# Altium schematic sheet 1_核心板.schdoc.schdoc
size 604 x 431 mm; Symbol: Sheet-Symbol_A4; Device: Sheet-Symbol_A4; Company: 嘉立创EDA; Version: V1.0; Page Size: A4; @Project Name: EP4CE22F17C8N; @Page Count: 1; @Update Date: 2023-09-30; @Create Date: 2023-07-21; @Schematic Name: Schematic1; @Page No: 1; @Page Name: 核心板
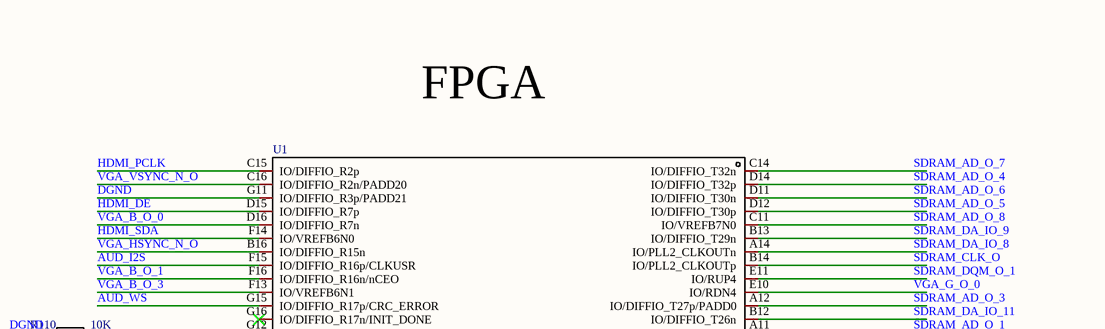
[diagram p0: 1_核心板.schdoc.schdoc, top left]
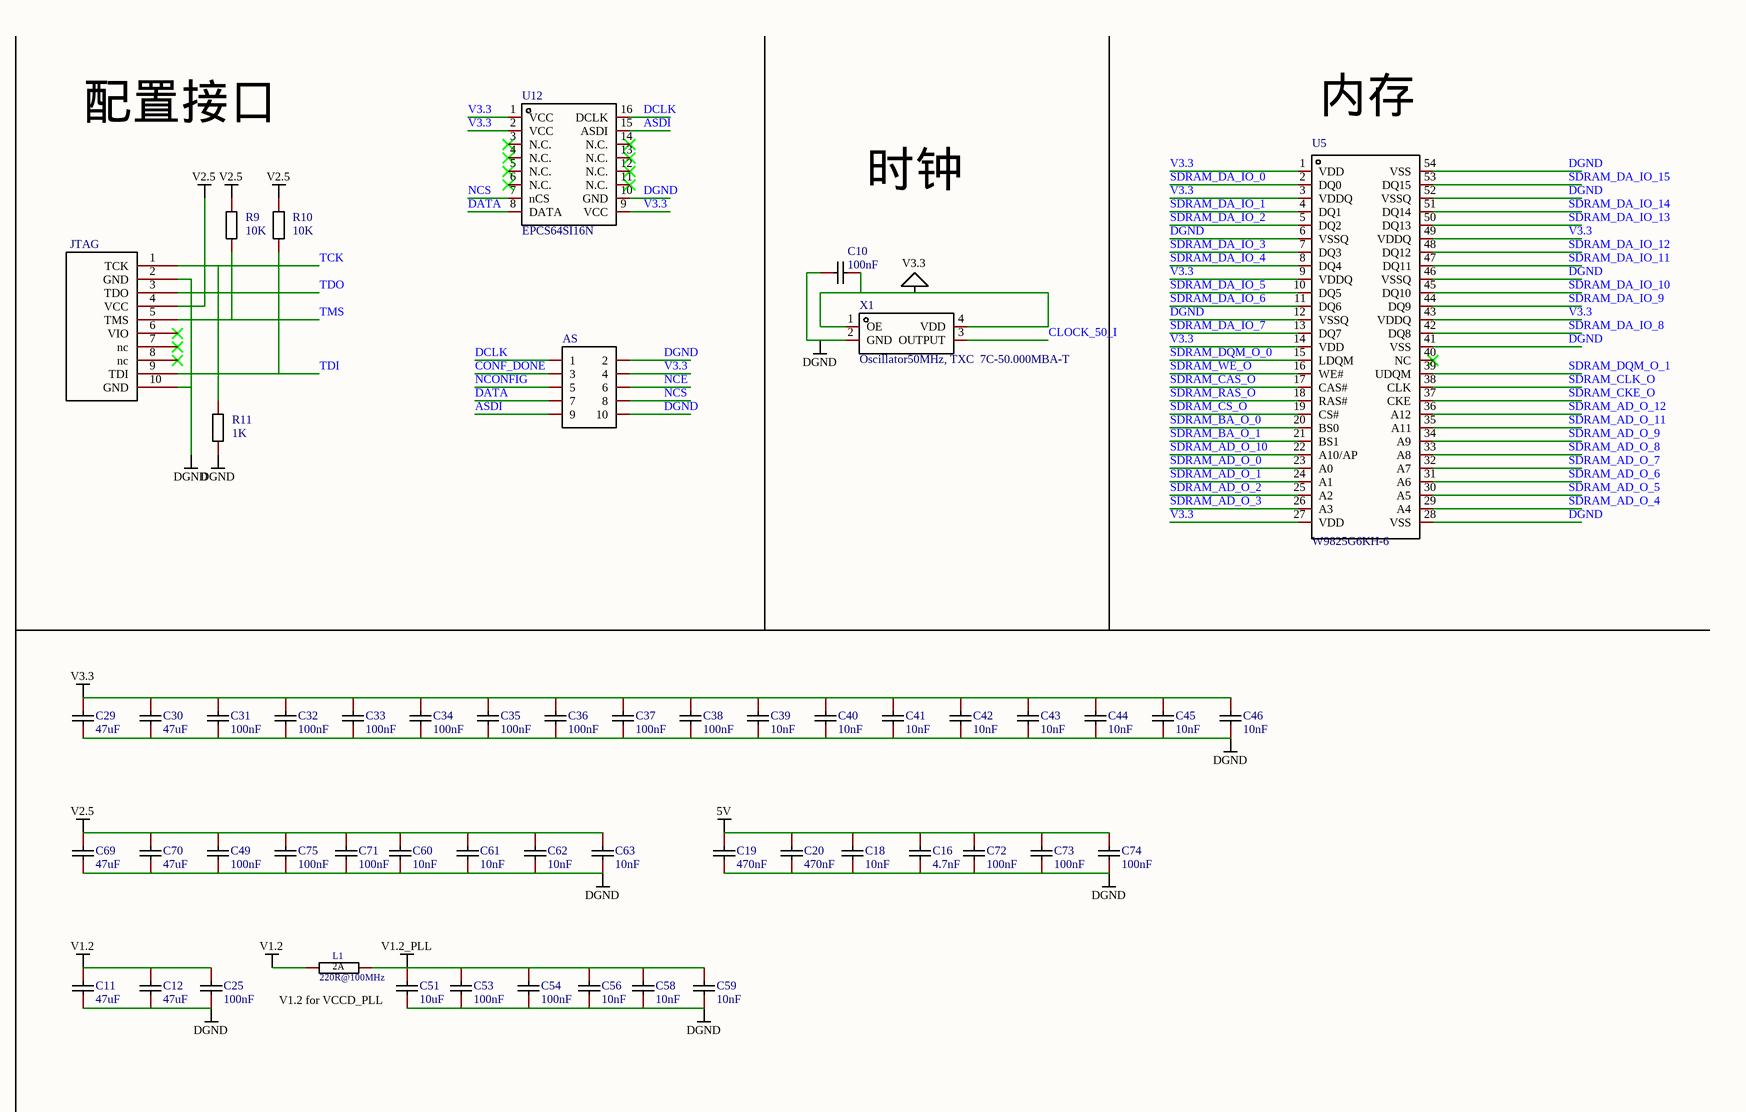
[diagram p1: 1_核心板.schdoc.schdoc, top right]
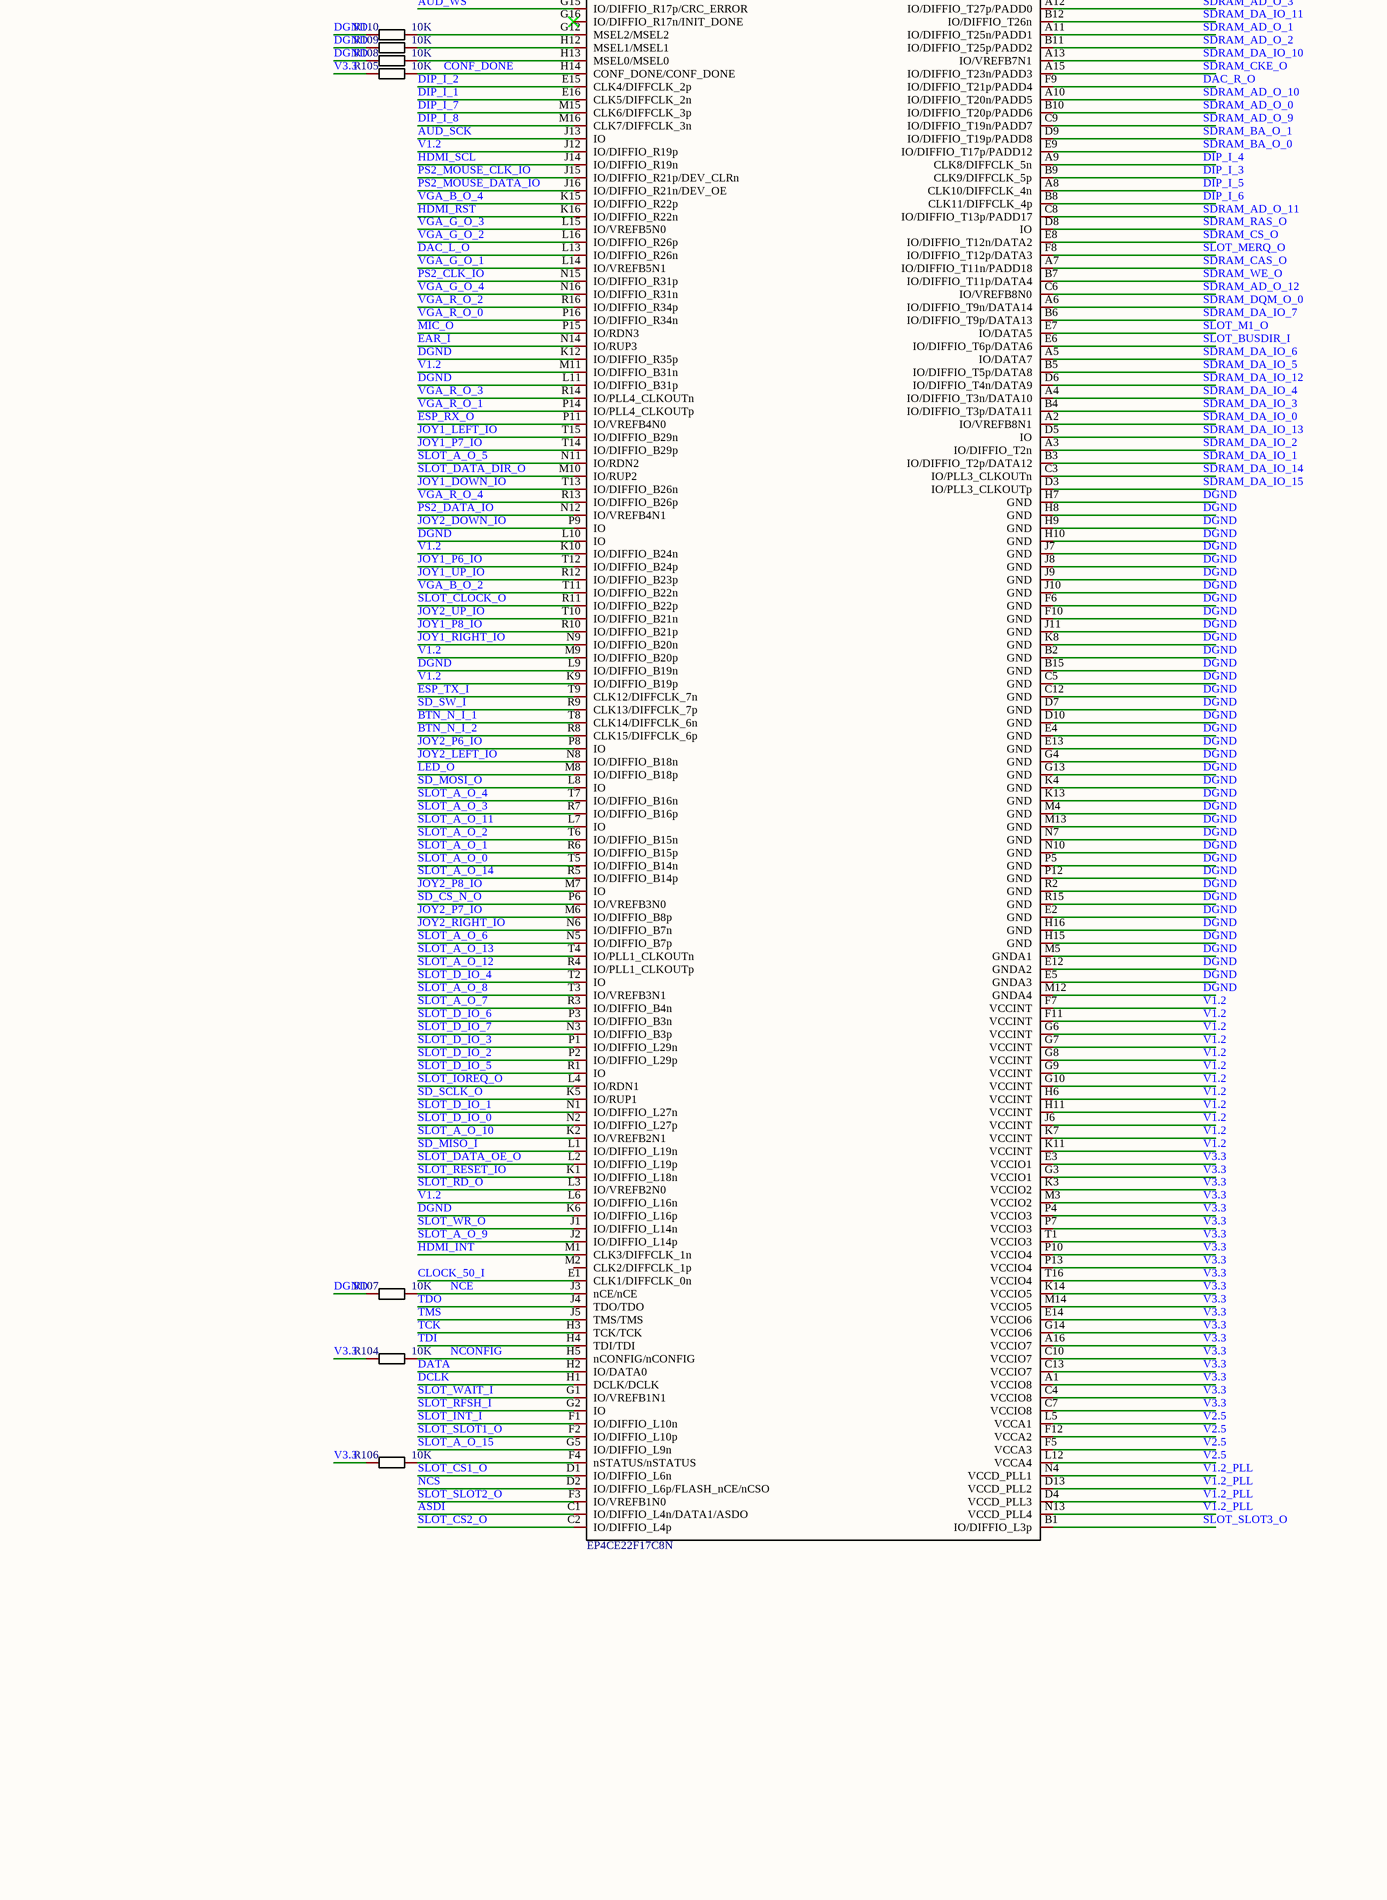
[diagram p2: 1_核心板.schdoc.schdoc, bottom left]
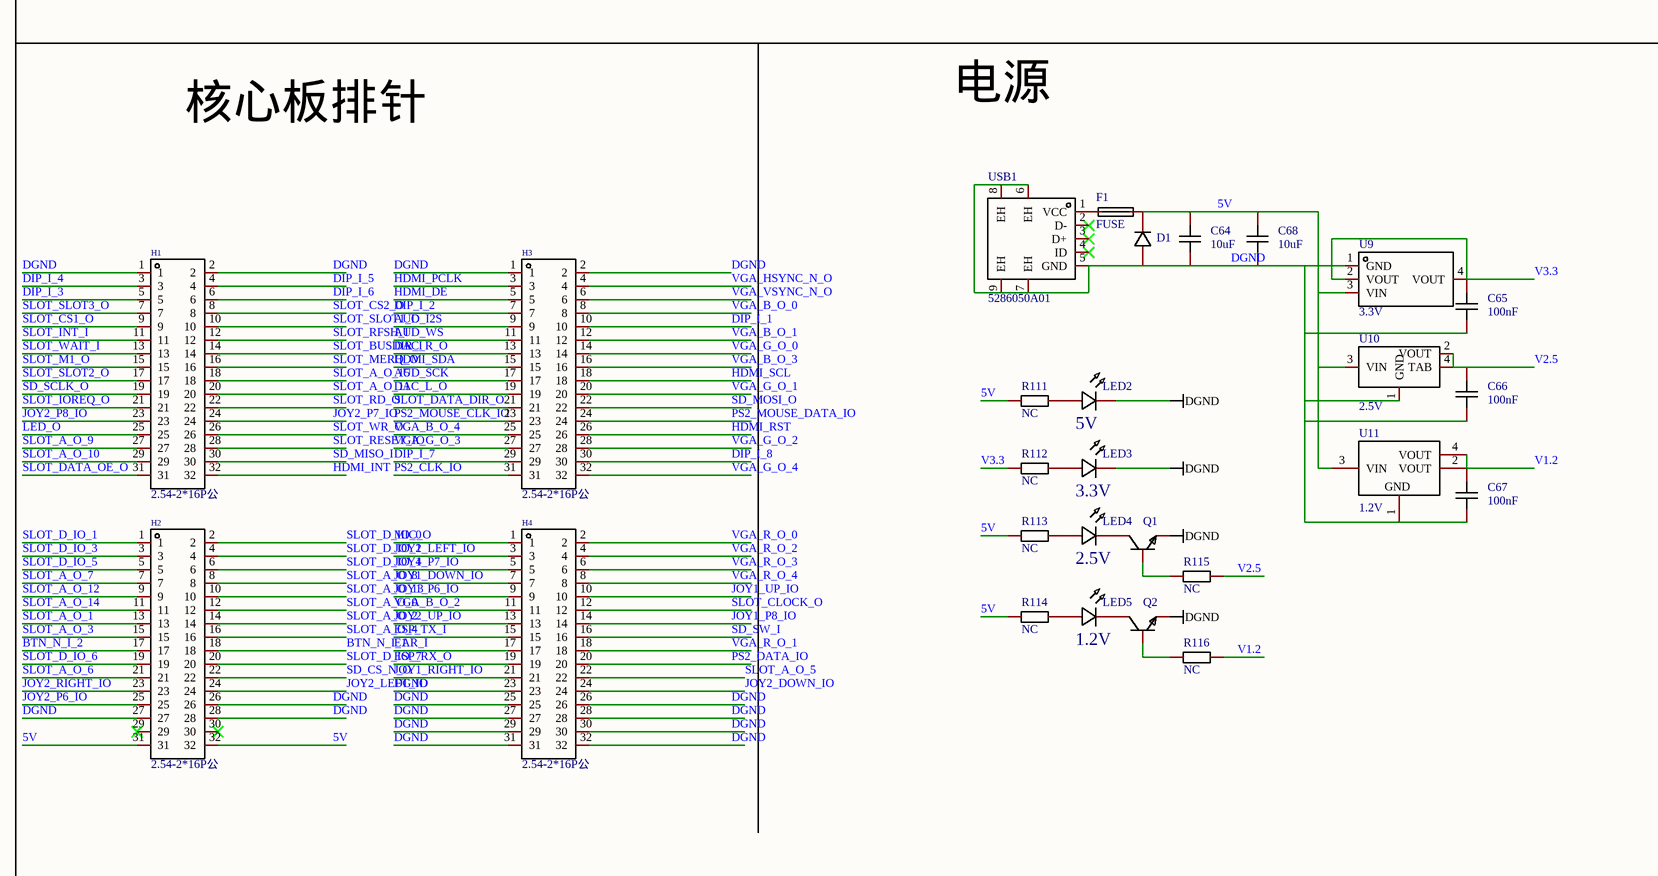
[diagram p3: 1_核心板.schdoc.schdoc, bottom right]

## Parts
AS  HDR-F_2.54_2x5  [HDR-TH_10P-P2.54-V-F-R2-C5-S2.54]  (value not drawn)
C10  100nF  [0603_3D]
C11  47uF  [0805_3D]
C12  47uF  [0805_3D]
C16  4.7nF  [0603_3D]
C18  10nF  [0603_3D]
C19  470nF  [0603_3D]
C20  470nF  [0603_3D]
C25  100nF  [0603_3D]
C29  47uF  [0805_3D]
C30  47uF  [0805_3D]
C31  100nF  [0603_3D]
C32  100nF  [0603_3D]
C33  100nF  [0603_3D]
C34  100nF  [0603_3D]
C35  100nF  [0603_3D]
C36  100nF  [0603_3D]
C37  100nF  [0603_3D]
C38  100nF  [0603_3D]
C39  10nF  [0603_3D]
C40  10nF  [0603_3D]
C41  10nF  [0603_3D]
C42  10nF  [0603_3D]
C43  10nF  [0603_3D]
C44  10nF  [0603_3D]
C45  10nF  [0603_3D]
C46  10nF  [0603_3D]
C49  100nF  [0603_3D]
C51  10uF  [0603_3D]
C53  100nF  [0603_3D]
C54  100nF  [0603_3D]
C56  10nF  [0603_3D]
C58  10nF  [0603_3D]
C59  10nF  [0603_3D]
C60  10nF  [0603_3D]
C61  10nF  [0603_3D]
C62  10nF  [0603_3D]
C63  10nF  [0603_3D]
C64  10uF  [C0805]
C65  100nF  [0603_3D]
C66  100nF  [0603_3D]
C67  100nF  [0603_3D]
C68  10uF  [C0805]
C69  47uF  [0805_3D]
C70  47uF  [0805_3D]
C71  100nF  [0603_3D]
C72  100nF  [0603_3D]
C73  100nF  [0603_3D]
C74  100nF  [0603_3D]
C75  100nF  [0603_3D]
D1  1N4148W  [SOD-123F_L2.7-W1.6-LS3.8-RD]  (value not drawn)
F1  FUSE  [F1206]
H1  2.54-2*16P公  [HDR-TH_32P-2.54-V-M-R2-C16-S2.54]
H2  2.54-2*16P公  [HDR-TH_32P-2.54-V-M-R2-C16-S2.54]
H3  2.54-2*16P公  [HDR-TH_32P-2.54-V-M-R2-C16-S2.54]
H4  2.54-2*16P公  [HDR-TH_32P-2.54-V-M-R2-C16-S2.54]
JTAG  JTAG  [HDR-TH_10P-P2.54-V-F-R2-C5-S2.54]  (value not drawn)
L1  220R@100MHz  [0603_3D]
LED2  5V  [LED_0603]
LED3  3.3V  [LED_0603]
LED4  2.5V  [LED_0603]
LED5  1.2V  [LED_0603]
Q1  S8050_SOT_NPN  [S8050_SOT-23]  (value not drawn)
Q2  S8050_SOT_NPN  [S8050_SOT-23]  (value not drawn)
R9  10k  [0603_3D]
R10  10k  [0603_3D]
R11  1k  [0603_3D]
R104  10k  [0603_3D]
R105  10k  [0603_3D]
R106  10k  [0603_3D]
R107  10k  [0603_3D]
R108  10k  [0603_3D]
R109  10k  [0603_3D]
R110  10k  [0603_3D]
R111  NC  [R0603]
R112  NC  [R0603]
R113  NC  [R0603]
R114  NC  [R0603]
R115  NC  [R0603]
R116  NC  [R0603]
U1  EP4CE22F17C8N  [FBGA-256_L17.0-W17.0-R16-C16-P1.00-TL]
U5  W9825G6KH-6  [TSOP-54_L22.2-W10.2-P0.80-LS11.8-BL]
U9  3.3V  [SOT-223-3_L6.5-W3.4-P2.30-LS7.0-BR]
U10  2.5V  [SOT-223_L6.7-W3.5-P2.30-BR]
U11  1.2V  [SOT-223-3_L6.5-W3.4-P2.30-LS7.0-BR]
U12  EPCS64SI16N  [SOIC-16_L12.8-W7.5-P1.27-LS10.3-BL]
USB1  5286050A01  [MINI-USB-SMD_PAI_MINUSB_5P]
X1  Oscillator50MHz, TXC  7C-50.000MBA-T  [OSC-SMD_4P-L3.2-W2.5-BL]

## Nets
5V: C16.2 C18.2 C19.2 C20.2 C64.2 C68.2 C72.2 C73.2 C74.2 D1.1(K) F1.2 H2.31 H2.32 R111.2 R113.1 R114.1 U9.3(VIN) U10.3(VIN) U11.3(VIN)
DGND: AS.2 AS.10 C10.2 C11.1 C12.1 C16.1 C18.1 C19.1 C20.1 C25.1 C29.1 C30.1 C31.1 C32.1 C33.1 C34.1 C35.1 C36.1 C37.1 C38.1 C39.1 C40.1 C41.1 C42.1 C43.1 C44.1 C45.1 C46.1 C49.1 C51.1 C53.1 C54.1 C56.1 C58.1 C59.1 C60.1 C61.1 C62.1 C63.1 C64.1 C65.1 C66.1 C67.1 C68.1 C69.1 C70.1 C71.1 C72.1 C73.1 C74.1 C75.1 D1.2(A) H1.1 H1.2 H2.26 H2.27 H2.28 H3.1 H3.2 H4.23 H4.25 H4.26 H4.27 H4.28 H4.29 H4.30 H4.31 H4.32 JTAG.2(GND) JTAG.10(GND) LED2.1(C) LED3.1(C) Q1.2 Q2.2 R11.2 R107.2 R108.2 R109.2 R110.2 U1.B2(GND) U1.B15(GND) U1.C5(GND) U1.C12(GND) U1.D7(GND) U1.D10(GND) U1.E2(GND) U1.E4(GND) U1.E5(GNDA3) U1.E12(GNDA2) U1.E13(GND) U1.F6(GND) U1.F10(GND) U1.G4(GND) U1.G11(IO/DIFFIO_R3p/PADD21) U1.G13(GND) U1.H7(GND) U1.H8(GND) U1.H9(GND) U1.H10(GND) U1.H15(GND) U1.H16(GND) U1.J7(GND) U1.J8(GND) U1.J9(GND) U1.J10(GND) U1.J11(GND) U1.K4(GND) U1.K6(IO/DIFFIO_L16p) U1.K8(GND) U1.K12(IO/DIFFIO_R35p) U1.K13(GND) U1.L9(IO/DIFFIO_B19n) U1.L10(IO) U1.L11(IO/DIFFIO_B31p) U1.M4(GND) U1.M5(GNDA1) U1.M12(GNDA4) U1.M13(GND) U1.N7(GND) U1.N10(GND) U1.P5(GND) U1.P12(GND) U1.R2(GND) U1.R15(GND) U5.6(VSSQ) U5.12(VSSQ) U5.28(VSS) U5.41(VSS) U5.46(VSSQ) U5.52(VSSQ) U5.54(VSS) U9.1(GND) U10.1(GND) U11.1(GND) U12.10(GND) USB1.5(GND) USB1.6(EH) USB1.7(EH) USB1.8(EH) USB1.9(EH) X1.2(GND)
V1.2: C11.2 C12.2 C25.2 C67.2 L1.1 R116.2 U1.F7(VCCINT) U1.F11(VCCINT) U1.G6(VCCINT) U1.G7(VCCINT) U1.G8(VCCINT) U1.G9(VCCINT) U1.G10(VCCINT) U1.H6(VCCINT) U1.H11(VCCINT) U1.J6(VCCINT) U1.J12(IO/DIFFIO_R19p) U1.K7(VCCINT) U1.K9(IO/DIFFIO_B19p) U1.K10(IO/DIFFIO_B24n) U1.K11(VCCINT) U1.L6(IO/DIFFIO_L16n) U1.M9(IO/DIFFIO_B20p) U1.M11(IO/DIFFIO_B31n) U11.2(VOUT) U11.4(VOUT)
V1.2_PLL: C51.2 C53.2 C54.2 C56.2 C58.2 C59.2 L1.2 U1.D4(VCCD_PLL3) U1.D13(VCCD_PLL2) U1.N4(VCCD_PLL1) U1.N13(VCCD_PLL4)
V2.5: C49.2 C60.2 C61.2 C62.2 C63.2 C66.2 C69.2 C70.2 C71.2 C75.2 JTAG.4(VCC) R9.2 R10.2 R115.2 U1.F5(VCCA3) U1.F12(VCCA2) U1.L5(VCCA1) U1.L12(VCCA4) U10.2(VOUT) U10.4(TAB)
V3.3: AS.4 C10.1 C29.2 C30.2 C31.2 C32.2 C33.2 C34.2 C35.2 C36.2 C37.2 C38.2 C39.2 C40.2 C41.2 C42.2 C43.2 C44.2 C45.2 C46.2 C65.2 R104.2 R105.2 R106.2 R112.2 U1.A1(VCCIO8) U1.A16(VCCIO7) U1.C4(VCCIO8) U1.C7(VCCIO8) U1.C10(VCCIO7) U1.C13(VCCIO7) U1.E3(VCCIO1) U1.E14(VCCIO6) U1.G3(VCCIO1) U1.G14(VCCIO6) U1.K3(VCCIO2) U1.K14(VCCIO5) U1.M3(VCCIO2) U1.M14(VCCIO5) U1.P4(VCCIO3) U1.P7(VCCIO3) U1.P10(VCCIO4) U1.P13(VCCIO4) U1.T1(VCCIO3) U1.T16(VCCIO4) U5.1(VDD) U5.3(VDDQ) U5.9(VDDQ) U5.14(VDD) U5.27(VDD) U5.43(VDDQ) U5.49(VDDQ) U9.2(VOUT) U9.4(VOUT) U12.1(VCC) U12.2(VCC) U12.9(VCC) X1.1(OE) X1.4(VDD)
ASDI: AS.9 U1.C1(IO/DIFFIO_L4n/DATA1/ASDO) U12.15(ASDI)
AUD_I2S: H3.9 U1.F15(IO/DIFFIO_R16p/CLKUSR)
AUD_SCK: H3.17 U1.J13(IO)
AUD_WS: H3.11 U1.G15(IO/DIFFIO_R17p/CRC_ERROR)
BTN_N_I_1: H2.18 U1.T8(CLK14/DIFFCLK_6n)
BTN_N_I_2: H2.17 U1.R8(CLK15/DIFFCLK_6p)
CLOCK_50_I: U1.E1(CLK1/DIFFCLK_0n) X1.3(OUTPUT)
CONF_DONE: AS.3 R105.1 U1.H14(CONF_DONE/CONF_DONE)
DAC_L_O: H3.19 U1.L13(IO/DIFFIO_R26n)
DAC_R_O: H3.13 U1.F9(IO/DIFFIO_T21p/PADD4)
DATA: AS.7 U1.H2(IO/DATA0) U12.8(DATA)
DCLK: AS.1 U1.H1(DCLK/DCLK) U12.16(DCLK)
DIP_I_1: H3.10 U1.E16(CLK5/DIFFCLK_2n)
DIP_I_2: H3.7 U1.E15(CLK4/DIFFCLK_2p)
DIP_I_3: H1.5 U1.B9(CLK9/DIFFCLK_5p)
DIP_I_4: H1.3 U1.A9(CLK8/DIFFCLK_5n)
DIP_I_5: H1.4 U1.A8(CLK10/DIFFCLK_4n)
DIP_I_6: H1.6 U1.B8(CLK11/DIFFCLK_4p)
DIP_I_7: H3.29 U1.M15(CLK6/DIFFCLK_3p)
DIP_I_8: H3.30 U1.M16(CLK7/DIFFCLK_3n)
EAR_I: H4.17 U1.N14(IO/RUP3)
ESP_RX_O: H4.19 U1.P11(IO/VREFB4N0)
ESP_TX_I: H4.15 U1.T9(CLK12/DIFFCLK_7n)
HDMI_DE: H3.5 U1.D15(IO/DIFFIO_R7p)
HDMI_INT: H1.32 U1.M1(CLK3/DIFFCLK_1n)
HDMI_PCLK: H3.3 U1.C15(IO/DIFFIO_R2p)
HDMI_RST: H3.26 U1.K16(IO/DIFFIO_R22n)
HDMI_SCL: H3.18 U1.J14(IO/DIFFIO_R19n)
HDMI_SDA: H3.15 U1.F14(IO/VREFB6N0)
JOY1_DOWN_IO: H4.7 U1.T13(IO/DIFFIO_B26n)
JOY1_LEFT_IO: H4.3 U1.T15(IO/DIFFIO_B29n)
JOY1_P6_IO: H4.9 U1.T12(IO/DIFFIO_B24p)
JOY1_P7_IO: H4.5 U1.T14(IO/DIFFIO_B29p)
JOY1_P8_IO: H4.14 U1.R10(IO/DIFFIO_B21p)
JOY1_RIGHT_IO: H4.21 U1.N9(IO/DIFFIO_B20n)
JOY1_UP_IO: H4.10 U1.R12(IO/DIFFIO_B23p)
JOY2_DOWN_IO: H4.24 U1.P9(IO)
JOY2_LEFT_IO: H2.24 U1.N8(IO/DIFFIO_B18n)
JOY2_P6_IO: H2.25 U1.P8(IO)
JOY2_P7_IO: H1.24 U1.M6(IO/DIFFIO_B8p)
JOY2_P8_IO: H1.23 U1.M7(IO)
JOY2_RIGHT_IO: H2.23 U1.N6(IO/DIFFIO_B7n)
JOY2_UP_IO: H4.13 U1.T10(IO/DIFFIO_B21n)
LED_O: H1.25 U1.M8(IO/DIFFIO_B18p)
MIC_O: H4.1 U1.P15(IO/RDN3)
NCE: AS.6 R107.1 U1.J3(nCE/nCE)
NCONFIG: AS.5 R104.1 U1.H5(nCONFIG/nCONFIG)
NCS: AS.8 U1.D2(IO/DIFFIO_L6p/FLASH_nCE/nCSO) U12.7(nCS)
PS2_CLK_IO: H3.31 U1.N15(IO/DIFFIO_R31p)
PS2_DATA_IO: H4.20 U1.N12(IO/VREFB4N1)
PS2_MOUSE_CLK_IO: H3.23 U1.J15(IO/DIFFIO_R21p/DEV_CLRn)
PS2_MOUSE_DATA_IO: H3.24 U1.J16(IO/DIFFIO_R21n/DEV_OE)
SD_CS_N_O: H2.22 U1.P6(IO/VREFB3N0)
SD_MISO_I: H1.30 U1.L1(IO/DIFFIO_L19n)
SD_MOSI_O: H3.22 U1.L8(IO)
SD_SCLK_O: H1.19 U1.K5(IO/RUP1)
SD_SW_I: H4.16 U1.R9(CLK13/DIFFCLK_7p)
SDRAM_AD_O_0: U1.B10(IO/DIFFIO_T20p/PADD6) U5.23(A0)
SDRAM_AD_O_1: U1.A11(IO/DIFFIO_T25n/PADD1) U5.24(A1)
SDRAM_AD_O_2: U1.B11(IO/DIFFIO_T25p/PADD2) U5.25(A2)
SDRAM_AD_O_3: U1.A12(IO/DIFFIO_T27p/PADD0) U5.26(A3)
SDRAM_AD_O_4: U1.D14(IO/DIFFIO_T32p) U5.29(A4)
SDRAM_AD_O_5: U1.D12(IO/DIFFIO_T30p) U5.30(A5)
SDRAM_AD_O_6: U1.D11(IO/DIFFIO_T30n) U5.31(A6)
SDRAM_AD_O_7: U1.C14(IO/DIFFIO_T32n) U5.32(A7)
SDRAM_AD_O_8: U1.C11(IO/VREFB7N0) U5.33(A8)
SDRAM_AD_O_9: U1.C9(IO/DIFFIO_T19n/PADD7) U5.34(A9)
SDRAM_AD_O_10: U1.A10(IO/DIFFIO_T20n/PADD5) U5.22(A10/AP)
SDRAM_AD_O_11: U1.C8(IO/DIFFIO_T13p/PADD17) U5.35(A11)
SDRAM_AD_O_12: U1.C6(IO/VREFB8N0) U5.36(A12)
SDRAM_BA_O_0: U1.E9(IO/DIFFIO_T17p/PADD12) U5.20(BS0)
SDRAM_BA_O_1: U1.D9(IO/DIFFIO_T19p/PADD8) U5.21(BS1)
SDRAM_CAS_O: U1.A7(IO/DIFFIO_T11n/PADD18) U5.17(CAS#)
SDRAM_CKE_O: U1.A15(IO/DIFFIO_T23n/PADD3) U5.37(CKE)
SDRAM_CLK_O: U1.B14(IO/PLL2_CLKOUTp) U5.38(CLK)
SDRAM_CS_O: U1.E8(IO/DIFFIO_T12n/DATA2) U5.19(CS#)
SDRAM_DA_IO_0: U1.A2(IO/VREFB8N1) U5.2(DQ0)
SDRAM_DA_IO_1: U1.B3(IO/DIFFIO_T2p/DATA12) U5.4(DQ1)
SDRAM_DA_IO_2: U1.A3(IO/DIFFIO_T2n) U5.5(DQ2)
SDRAM_DA_IO_3: U1.B4(IO/DIFFIO_T3p/DATA11) U5.7(DQ3)
SDRAM_DA_IO_4: U1.A4(IO/DIFFIO_T3n/DATA10) U5.8(DQ4)
SDRAM_DA_IO_5: U1.B5(IO/DIFFIO_T5p/DATA8) U5.10(DQ5)
SDRAM_DA_IO_6: U1.A5(IO/DATA7) U5.11(DQ6)
SDRAM_DA_IO_7: U1.B6(IO/DIFFIO_T9p/DATA13) U5.13(DQ7)
SDRAM_DA_IO_8: U1.A14(IO/PLL2_CLKOUTn) U5.42(DQ8)
SDRAM_DA_IO_9: U1.B13(IO/DIFFIO_T29n) U5.44(DQ9)
SDRAM_DA_IO_10: U1.A13(IO/VREFB7N1) U5.45(DQ10)
SDRAM_DA_IO_11: U1.B12(IO/DIFFIO_T26n) U5.47(DQ11)
SDRAM_DA_IO_12: U1.D6(IO/DIFFIO_T4n/DATA9) U5.48(DQ12)
SDRAM_DA_IO_13: U1.D5(IO) U5.50(DQ13)
SDRAM_DA_IO_14: U1.C3(IO/PLL3_CLKOUTn) U5.51(DQ14)
SDRAM_DA_IO_15: U1.D3(IO/PLL3_CLKOUTp) U5.53(DQ15)
SDRAM_DQM_O_0: U1.A6(IO/DIFFIO_T9n/DATA14) U5.15(LDQM)
SDRAM_DQM_O_1: U1.E11(IO/RUP4) U5.39(UDQM)
SDRAM_RAS_O: U1.D8(IO) U5.18(RAS#)
SDRAM_WE_O: U1.B7(IO/DIFFIO_T11p/DATA4) U5.16(WE#)
SLOT_A_O_0: H2.12 U1.T5(IO/DIFFIO_B14n)
SLOT_A_O_1: H2.13 U1.R6(IO/DIFFIO_B15p)
SLOT_A_O_2: H2.14 U1.T6(IO/DIFFIO_B15n)
SLOT_A_O_3: H2.15 U1.R7(IO/DIFFIO_B16p)
SLOT_A_O_4: H2.16 U1.T7(IO/DIFFIO_B16n)
SLOT_A_O_5: H4.22 U1.N11(IO/RDN2)
SLOT_A_O_6: H2.21 U1.N5(IO/DIFFIO_B7p)
SLOT_A_O_7: H2.7 U1.R3(IO/DIFFIO_B4n)
SLOT_A_O_8: H2.8 U1.T3(IO/VREFB3N1)
SLOT_A_O_9: H1.27 U1.J2(IO/DIFFIO_L14p)
SLOT_A_O_10: H1.29 U1.K2(IO/VREFB2N1)
SLOT_A_O_11: H1.20 U1.L7(IO)
SLOT_A_O_12: H2.9 U1.R4(IO/PLL1_CLKOUTp)
SLOT_A_O_13: H2.10 U1.T4(IO/PLL1_CLKOUTn)
SLOT_A_O_14: H2.11 U1.R5(IO/DIFFIO_B14p)
SLOT_A_O_15: H1.18 U1.G5(IO/DIFFIO_L9n)
SLOT_BUSDIR_I: H1.14 U1.E6(IO/DIFFIO_T6p/DATA6)
SLOT_CLOCK_O: H4.12 U1.R11(IO/DIFFIO_B22p)
SLOT_CS1_O: H1.9 U1.D1(IO/DIFFIO_L6n)
SLOT_CS2_O: H1.8 U1.C2(IO/DIFFIO_L4p)
SLOT_D_IO_0: H2.2 U1.N2(IO/DIFFIO_L27p)
SLOT_D_IO_1: H2.1 U1.N1(IO/DIFFIO_L27n)
SLOT_D_IO_2: H2.4 U1.P2(IO/DIFFIO_L29p)
SLOT_D_IO_3: H2.3 U1.P1(IO/DIFFIO_L29n)
SLOT_D_IO_4: H2.6 U1.T2(IO)
SLOT_D_IO_5: H2.5 U1.R1(IO)
SLOT_D_IO_6: H2.19 U1.P3(IO/DIFFIO_B3n)
SLOT_D_IO_7: H2.20 U1.N3(IO/DIFFIO_B3p)
SLOT_DATA_DIR_O: H3.21 U1.M10(IO/RUP2)
SLOT_DATA_OE_O: H1.31 U1.L2(IO/DIFFIO_L19p)
SLOT_INT_I: H1.11 U1.F1(IO/DIFFIO_L10n)
SLOT_IOREQ_O: H1.21 U1.L4(IO/RDN1)
SLOT_M1_O: H1.15 U1.E7(IO/DATA5)
SLOT_MERQ_O: H1.16 U1.F8(IO/DIFFIO_T12p/DATA3)
SLOT_RD_O: H1.22 U1.L3(IO/VREFB2N0)
SLOT_RESET_IO: H1.28 U1.K1(IO/DIFFIO_L18n)
SLOT_RFSH_I: H1.12 U1.G2(IO)
SLOT_SLOT1_O: H1.10 U1.F2(IO/DIFFIO_L10p)
SLOT_SLOT2_O: H1.17 U1.F3(IO/VREFB1N0)
SLOT_SLOT3_O: H1.7 U1.B1(IO/DIFFIO_L3p)
SLOT_WAIT_I: H1.13 U1.G1(IO/VREFB1N1)
SLOT_WR_O: H1.26 U1.J1(IO/DIFFIO_L14n)
TCK: JTAG.1(TCK) R11.1 U1.H3(TCK/TCK)
TDI: JTAG.9(TDI) R10.1 U1.H4(TDI/TDI)
TDO: JTAG.3(TDO) U1.J4(TDO/TDO)
TMS: JTAG.5(TMS) R9.1 U1.J5(TMS/TMS)
VGA_B_O_0: H3.8 U1.D16(IO/DIFFIO_R7n)
VGA_B_O_1: H3.12 U1.F16(IO/DIFFIO_R16n/nCEO)
VGA_B_O_2: H4.11 U1.T11(IO/DIFFIO_B22n)
VGA_B_O_3: H3.16 U1.F13(IO/VREFB6N1)
VGA_B_O_4: H3.25 U1.K15(IO/DIFFIO_R22p)
VGA_G_O_0: H3.14 U1.E10(IO/RDN4)
VGA_G_O_1: H3.20 U1.L14(IO/VREFB5N1)
VGA_G_O_2: H3.28 U1.L16(IO/DIFFIO_R26p)
VGA_G_O_3: H3.27 U1.L15(IO/VREFB5N0)
VGA_G_O_4: H3.32 U1.N16(IO/DIFFIO_R31n)
VGA_HSYNC_N_O: H3.4 U1.B16(IO/DIFFIO_R15n)
VGA_R_O_0: H4.2 U1.P16(IO/DIFFIO_R34n)
VGA_R_O_1: H4.18 U1.P14(IO/PLL4_CLKOUTp)
VGA_R_O_2: H4.4 U1.R16(IO/DIFFIO_R34p)
VGA_R_O_3: H4.6 U1.R14(IO/PLL4_CLKOUTn)
VGA_R_O_4: H4.8 U1.R13(IO/DIFFIO_B26p)
VGA_VSYNC_N_O: H3.6 U1.C16(IO/DIFFIO_R2n/PADD20)
NetF1_1: F1.1 USB1.1(VCC)
NetLED2_2: LED2.2(A) R111.1
NetLED3_2: LED3.2(A) R112.1
NetLED4_1: LED4.1(C) Q1.3
NetLED4_2: LED4.2(A) R113.2
NetLED5_1: LED5.1(C) Q2.3
NetLED5_2: LED5.2(A) R114.2
NetQ1_1: Q1.1 R115.1
NetQ2_1: Q2.1 R116.1
NetR106_1: R106.1 U1.F4(nSTATUS/nSTATUS)
NetR108_1: R108.1 U1.H13(MSEL0/MSEL0)
NetR109_1: R109.1 U1.H12(MSEL1/MSEL1)
NetR110_1: R110.1 U1.G12(MSEL2/MSEL2)

Not connected (* = marked no-connect by the designer): H2 29* 30*; JTAG 6(VIO)* 7(nc)* 8(nc)*; U1 G16(IO/DIFFIO_R17n/INIT_DONE)* M2(CLK2/DIFFCLK_1p); U5 40(NC)*; U12 3(N.C.)* 4(N.C.)* 5(N.C.)* 6(N.C.)* 11(N.C.)* 12(N.C.)* 13(N.C.)* 14(N.C.)*; USB1 2(D-)* 3(D+)* 4(ID)*

## Notes on the sheet
- FPGA
- 配置接口
- (near U5) 内存
- 时钟
- V1.2 for VCCD_PLL
- 核心板排针
- 电源
- 1
- 2
- 3
- 4
- 5
- 6
- A
- B
- C
- D
- 原理图
- Schematic1
- 创建日期
- 更新日期
- 2023-09-30
- 2023-07-21
- 审阅
- 绘制
- 图页
- 核心板
- 物料编码
- EP4CE22F17C8N
- 版本
- 尺寸
- 页
- 共
- V1.0
- A4
- 嘉立创EDA

## Library data of the parts
AS = HDR-F_2.54_2x5: Symbol: HDR-F-2.54_2x5; Convert to PCB: yes; Device: HDR-F_2.54_2x5; Add into BOM: yes; Supplier Part: C92270; Supplier Footprint: 插件
C10 = 100nF: Capacitor; #Manufacturer: Generic Components; Symbol: C; #Publisher: Dr. A. Heinzelmann; #Class: Passive; Initial Voltage: 0V; Origin Footprint 2: 1210; Origin Footprint 3: CC-Type-B-3528; Origin Footprint 4: 1206; Origin Footprint 5: 0402; Origin Footprint 6: 1812; Origin Footprint 7: 0402 - R; Origin Footprint 8: 0805 - R; Origin Footprint 9: 1206 - R; Add into BOM: yes; Name: 100nF; Device: 100nF; #Published: 2006-10-07; #ClassSub: Capacitor; Type: *; Voltage Maximum: *; Value: 100nF; Convert to PCB: yes; Origin Footprint 1: 0603_3D; Design Item ID: C; Library Name: EFS_Sensorboard
C11 C12 C29 C30 C69 C70 = 47uF: Capacitor; #Manufacturer: Generic Components; Symbol: C; #Publisher: Dr. A. Heinzelmann; #Class: Passive; Initial Voltage: 0V; Type: Ceramic; Origin Footprint 2: 1210; Origin Footprint 3: CC-Type-B-3528; Origin Footprint 4: 1206; Origin Footprint 5: 0402; Origin Footprint 6: 1812; Origin Footprint 7: 0402 - R; Origin Footprint 8: 1206 - R; Origin Footprint 9: 0603_3D; Add into BOM: yes; Name: 47uF; Device: 47uF; #Published: 2006-10-07; #ClassSub: Capacitor; Voltage Maximum: *; Value: 47uF; Convert to PCB: yes; Origin Footprint 1: 0805_3D; Design Item ID: C; Library Name: EFS_Sensorboard
C16 = 4.7nF: Capacitor; #Manufacturer: Generic Components; Symbol: C; #Publisher: Dr. A. Heinzelmann; #Class: Passive; Initial Voltage: 0V; Origin Footprint 2: 1210; Origin Footprint 3: CC-Type-B-3528; Origin Footprint 4: 1206; Origin Footprint 5: 0402_3D; Origin Footprint 6: 1812; Origin Footprint 8: 0805 - R; Origin Footprint 9: 1206 - R; Add into BOM: yes; Name: 4.7nF; Device: 4.7nF; #Published: 2006-10-07; #ClassSub: Capacitor; Type: *; Voltage Maximum: *; Value: 4.7nF; Origin Footprint 7: 0402_3D; Convert to PCB: yes; Origin Footprint 1: 0402_3D; Design Item ID: C; Library Name: EFS_Sensorboard
C18 = 10nF: Capacitor; #Manufacturer: Generic Components; Symbol: C; #Publisher: Dr. A. Heinzelmann; #Class: Passive; Initial Voltage: 0V; Origin Footprint 2: 1210; Origin Footprint 3: CC-Type-B-3528; Origin Footprint 4: 1206; Origin Footprint 5: 0402_3D; Origin Footprint 6: 1812; Origin Footprint 8: 0805 - R; Origin Footprint 9: 1206 - R; Add into BOM: yes; Name: 10nF; Device: 10nF; #Published: 2006-10-07; #ClassSub: Capacitor; Type: *; Voltage Maximum: *; Value: 10nF; Origin Footprint 7: 0402_3D; Convert to PCB: yes; Origin Footprint 1: 0402_3D; Design Item ID: C; Library Name: EFS_Sensorboard
C19 C20 = 470nF: Capacitor; #Manufacturer: Generic Components; Symbol: C; #Publisher: Dr. A. Heinzelmann; #Class: Passive; Initial Voltage: 0V; Origin Footprint 2: 1210; Origin Footprint 3: CC-Type-B-3528; Origin Footprint 4: 1206; Origin Footprint 5: 0402_3D; Origin Footprint 6: 1812; Origin Footprint 7: 0402 - R; Origin Footprint 8: 0805 - R; Origin Footprint 9: 1206 - R; Add into BOM: yes; Name: 470nF; Device: 470nF; #Published: 2006-10-07; #ClassSub: Capacitor; Type: *; Voltage Maximum: *; Value: 470nF; Convert to PCB: yes; Origin Footprint 1: 0603_3D; Design Item ID: C; Library Name: EFS_Sensorboard
C25 C72-C74 = 100nF: Capacitor; #Manufacturer: Generic Components; Symbol: C; #Publisher: Dr. A. Heinzelmann; #Class: Passive; Initial Voltage: 0V; Origin Footprint 2: 1210; Origin Footprint 3: CC-Type-B-3528; Origin Footprint 4: 1206; Origin Footprint 5: 0402_3D; Origin Footprint 6: 1812; Origin Footprint 8: 0805 - R; Origin Footprint 9: 1206 - R; Add into BOM: yes; Name: 100nF; Device: 100nF; #Published: 2006-10-07; #ClassSub: Capacitor; Type: *; Voltage Maximum: *; Value: 100nF; Origin Footprint 7: 0402_3D; Convert to PCB: yes; Origin Footprint 1: 0402_3D; Design Item ID: C; Library Name: EFS_Sensorboard
C31-C38 C49 C53 C54 C71 C75 = 100nF: Capacitor; #Manufacturer: Generic Components; Symbol: C; #Publisher: Dr. A. Heinzelmann; #Class: Passive; Initial Voltage: 0V; Origin Footprint 2: 1210; Origin Footprint 3: CC-Type-B-3528; Origin Footprint 4: 1206; Origin Footprint 5: 0402; Origin Footprint 6: 1812; Origin Footprint 7: 0402 - R; Origin Footprint 8: 0805 - R; Origin Footprint 9: 1206 - R; Add into BOM: yes; Origin Footprint 1: 0402_3D; Name: 100nF; Device: 100nF; #Published: 2006-10-07; #ClassSub: Capacitor; Type: *; Voltage Maximum: *; Value: 100nF; Convert to PCB: yes; Design Item ID: C; Library Name: EFS_Sensorboard
C39-C46 = 10nF: Capacitor; #Manufacturer: Generic Components; Symbol: C; #Publisher: Dr. A. Heinzelmann; #Class: Passive; Initial Voltage: 0V; Origin Footprint 2: 1210; Origin Footprint 3: CC-Type-B-3528; Origin Footprint 4: 1206; Origin Footprint 5: 0402; Origin Footprint 6: 1812; Origin Footprint 7: 0402 - R; Origin Footprint 8: 0805 - R; Origin Footprint 9: 1206 - R; Add into BOM: yes; Origin Footprint 1: 0402_3D; Name: 10nF; Device: 10nF; #Published: 2006-10-07; #ClassSub: Capacitor; Type: *; Voltage Maximum: *; Value: 10nF; Convert to PCB: yes; Design Item ID: C; Library Name: EFS_Sensorboard
C51 = 10uF: Capacitor; #Manufacturer: Generic Components; Symbol: C; #Publisher: Dr. A. Heinzelmann; #Class: Passive; Initial Voltage: 0V; Origin Footprint 2: 1210; Origin Footprint 3: CC-Type-B-3528; Origin Footprint 4: 1206; Origin Footprint 5: 0402; Origin Footprint 6: 1812; Origin Footprint 7: 0402 - R; Origin Footprint 8: 0805 - R; Origin Footprint 9: 1206 - R; Add into BOM: yes; Name: 10uF; Device: 10uF; #Published: 2006-10-07; #ClassSub: Capacitor; Type: *; Voltage Maximum: *; Value: 10uF; Convert to PCB: yes; Origin Footprint 1: 0603_3D; Design Item ID: C; Library Name: EFS_Sensorboard
C56 C58-C63 = 10nF: Capacitor; #Manufacturer: Generic Components; Symbol: C; #Publisher: Dr. A. Heinzelmann; #Class: Passive; Initial Voltage: 0V; Origin Footprint 2: 1210; Origin Footprint 3: CC-Type-B-3528; Origin Footprint 4: 1206; Origin Footprint 5: 0402_3D; Origin Footprint 6: 1812; Origin Footprint 7: 0402 - R; Origin Footprint 8: 0805 - R; Origin Footprint 9: 1206 - R; Add into BOM: yes; Name: 10nF; Device: 10nF; #Published: 2006-10-07; #ClassSub: Capacitor; Type: *; Voltage Maximum: *; Value: 10nF; Convert to PCB: yes; Origin Footprint 1: 0402_3D; Design Item ID: C; Library Name: EFS_Sensorboard
C64 C68 = CAP_0805: Symbol: CapAcitance; Convert to PCB: yes; Name: 10uF; Device: CAP_0805; Add into BOM: yes; Supplier Footprint: 0805; Value: 10uF
C65-C67 = CAP_0603: Symbol: CapAcitance; Convert to PCB: yes; Name: 100nF; Device: CAP_0603; Add into BOM: yes; Supplier Footprint: 0603; Value: 100nF
D1 = 1N4148W_C81598: Manufacturer: ST(先科); Add into BOM: yes; Diode Configuration: 独立式; Power Dissipation: 400mW; Reverse Voltage (Vr): 75V; Average Rectified Current (Io): 150mA; Forward Voltage (Vf@If): 1V@50mA; Reverse Leakage Current: 1uA@75V; Reverse Recovery Time (trr): 4ns; Description: 二极管配置:独立式;功率:400mW;直流反向耐压(Vr):75V;平均整流电流(Io):150mA;正向压降(Vf):1V@50mA;反向恢复时间(trr):4ns;; Name: 1N4148W; Symbol: 1N4148W_C81598; Device: 1N4148W_C81598; LCSC Part Name: 75V 150mA 4ns; Supplier Part: C81598; Manufacturer Part: 1N4148W; Supplier Footprint: SOD-123; JLCPCB Part Class: 基础库; Datasheet: https://atta.szlcsc.com/upload/public/pdf/source/20161024/1477288446905.pdf; Supplier: LCSC; Convert to PCB: yes; Operating Temperature: +150℃@(Tj)
F1 = FUSE: Add into BOM: yes; Name: FUSE; Symbol: FUSE; Device: FUSE; LCSC Part Name: FUSE; Supplier Part: C9900021114; Manufacturer Part: FUSE; Supplier Footprint: F1206; JLCPCB Part Class: 扩展库; Supplier: LCSC; Convert to PCB: yes
H1-H4 = X6521WV-2x16H-C30D60: Manufacturer: XKB Connectivity(中国星坤); Symbol: X6521WV-2×16H-C30D60; Add into BOM: yes; Pitch: 2.54mm; Pin Structure: 2x16P; Circluar Pins/Square Pins: 方针; Current Rating (Max): 3A; Voltage Rating (Max): 250V; Welding Temperature (Max): 260℃; Description: 排数:双排;总PIN位数:32;间距:2.54mm;插针结构:2x16P;行距:2.54mm;安装类型:直插;圆针/方针:方针;额定电流:3A;额定电压:250V;配合针长度:6mm;塑高:2.5mm;端接针长度:3mm;触头材质:黄铜;触头镀层:金;工作温度范围:-40℃~+105℃;焊接温度(最大值):260℃;颜色:黑色;; Name: 2.54-2*16P公; Device: X6521WV-2x16H-C30D60; Supplier: LCSC; Supplier Part: C725888; Manufacturer Part: 2.54-2*16P公; JLCPCB Part Class: 扩展库; LCSC Part Name: 2.54mm 2x16P 直插 方针; Supplier Footprint: 插件,P=2.54mm; Convert to PCB: yes; Number of Rows: 双排; Number of Pins: 32; Row Spacing: 2.54mm; Mounting Type: 直插; Length of Mating Pin: 6mm; Insulation Height: 2.5mm; Length of End Connection Pin: 3mm; Contact Material: 黄铜; Contact Plating: 金; Operating Temperature Range: -40℃~+105℃; Color: 黑色
JTAG = JTAG: Altera JTAG; Add into BOM: yes; Origin Footprint: MicroMatch_10PinSMD; Name: JTAG; Symbol: AlteraJTAG; Device: JTAG; Convert to PCB: yes; Design Item ID: AlteraJTAG; Library Name: AirBotOne
L1 = 220R@100MHz: 220R@100MHz 2A EMI FILTER; Symbol: L-220R@100MHz-2A-25%-0603; Tolerance: 25%; Add into BOM: yes; Name: 220R@100MHz; Device: 220R@100MHz; Rating: 2A; Value: 220R@100MHz; Convert to PCB: yes; Origin Footprint: 0603_3D; Design Item ID: L-220R@100MHz-2A-25%-0603; Library Name: Viola
LED2-LED5 = LED_0603-R: Symbol: LED_R; Convert to PCB: yes; Device: LED_0603-R; Add into BOM: yes; Supplier Footprint: 0603
  LED2: Name: 5V
  LED3: Name: 3.3V
  LED4: Name: 2.5V
  LED5: Name: 1.2V
Q1 Q2 = S8050_SOT_NPN: Symbol: NPN; Convert to PCB: yes; Device: S8050_SOT_NPN; Add into BOM: yes; Supplier Footprint: SOT-23
R9 R10 R104-R110 = 10k: Resistor; #Manufacturer: Generic Components; Symbol: R; #Publisher: Dr. A. Heinzelmann; #Class: Passive; Origin Footprint 2: 0805; Origin Footprint 3: 1206; Origin Footprint 4: 0402; Origin Footprint 5: 0402 - R; Origin Footprint 6: 1206 - R; Origin Footprint 7: 0603 - R; Origin Footprint 8: 0805 - R; Origin Footprint 9: 2512[6332]; Origin Footprint 10: 2010[5025]; Origin Footprint 11: 02016; Origin Footprint 12: AXIAL-0.4; Add into BOM: yes; Name: 10k; Device: 10k; #Published: 2006-10-06; #ClassSub: Resistor; Type: *; Value: 10K; Convert to PCB: yes; Origin Footprint 1: 0603_3D; Design Item ID: R; Library Name: ELE-LIB
R11 = 1k: Resistor; #Manufacturer: Generic Components; Symbol: R; #Publisher: Dr. A. Heinzelmann; #Class: Passive; Origin Footprint 2: 0805; Origin Footprint 3: 1206; Origin Footprint 4: 0402; Origin Footprint 5: 0402 - R; Origin Footprint 6: 1206 - R; Origin Footprint 7: 0603 - R; Origin Footprint 8: 0805 - R; Origin Footprint 9: 2512[6332]; Origin Footprint 10: 2010[5025]; Origin Footprint 11: 02016; Origin Footprint 12: AXIAL-0.4; Add into BOM: yes; Name: 1k; Device: 1k; #Published: 2006-10-06; #ClassSub: Resistor; Type: *; Value: 1K; Convert to PCB: yes; Origin Footprint 1: 0603_3D; Design Item ID: R; Library Name: ELE-LIB
R111-R116 = 50M-1: Add into BOM: yes; Name: NC; Symbol: 50M-1; Device: 50M-1; LCSC Part Name: 50M-1; Supplier Part: C9900001747; Manufacturer Part: NC; Supplier Footprint: R0603; JLCPCB Part Class: 扩展库; Datasheet: 2021-11-11/138973A/35fb8c82b90f4abb8fa686d244170bd1/50MΩR0603.PDF; Supplier: LCSC; Convert to PCB: yes
U1 = EP4CE22F17C8N: Symbol: EP4CE22F17C8N_C1521941; Add into BOM: yes; Description: 可编程类型:-;逻辑元件/块数:-;宏单元数:-;I/O 数:-;工作温度:-;; Name: EP4CE22F17C8N; Device: EP4CE22F17C8N; LCSC Part Name: EP4CE22F17C8N; Supplier Part: C1521941; Manufacturer Part: EP4CE22F17C8N; Supplier Footprint: FBGA-256(17x17); Supplier: LCSC; Convert to PCB: yes; Programmable Type: -; Number of Logic Elements/Blocks: -; Number of Macrocells: -; Number of I/O: -; Operating Temperature: -
U5 = W9825G6KH-6: Manufacturer: WINBOND(华邦); Add into BOM: yes; Name: W9825G6KH-6; Symbol: W9825G6KH-6; Device: W9825G6KH-6; LCSC Part Name: W9825G6KH-6; Supplier Part: C62246; Manufacturer Part: W9825G6KH-6; Supplier Footprint: TSOP-54-10.2mm; JLCPCB Part Class: 扩展库; Datasheet: https://atta.szlcsc.com/upload/public/pdf/source/20170322/1490151652935.pdf; Supplier: LCSC; Convert to PCB: yes
U9 = AMS1117-3.3_C6186: Manufacturer: AMS; Add into BOM: yes; Output Type: 固定; Output Polarity: 正; Number of Outputs: 1; Dropout Voltage: 1.3V@(800mA); Output Current: 1A; Power Supply Rejection Ratio (PSRR): 72dB@(120Hz); Description: 输出类型:固定;输出极性:正;最大输入电压:-;输出电压:3.3V;输出电流:1A;电源纹波抑制比(PSRR):72dB@(120Hz);; Name: 3.3V; Symbol: AMS1117-3.3; Device: AMS1117-3.3_C6186; LCSC Part Name: 输出3.3V 1A; Supplier Part: C6186; Manufacturer Part: 3.3V; Supplier Footprint: SOT-223; JLCPCB Part Class: 基础库; Datasheet: https://atta.szlcsc.com/upload/public/pdf/source/20180727/C6186_7A095716F0823C02F1997A905E26C086.pdf; Supplier: LCSC; Convert to PCB: yes; Maximum Input Voltage: -; Output Voltage: 3.3V; Quiescent Current (Ground Current): -; Noise: -; Feature: -; Operating Temperature: -
U10 = AMS1117-2.5V: Add into BOM: yes; Description: 输出类型:固定;输出极性:正;输出通道数:1;最大输入电压:18V;输出电压:2.5V;压差:1.3V@(1A);输出电流:1A;电源纹波抑制比(PRSS):60dB@(120Hz);; Name: 2.5V; Symbol: AMS1117; Device: AMS1117-2.5V; LCSC Part Name: SK12D07VG3; Supplier Part: C347221; Manufacturer Part: 2.5V; Supplier Footprint: SOT-223; JLCPCB Part Class: 扩展库; Datasheet: https://atta.szlcsc.com/upload/public/pdf/source/20160702/1467448296695.pdf; Supplier: LCSC; Convert to PCB: yes
U11 = LD1117AG-1.2V: Add into BOM: yes; Description: 最大输入电压:15V;压降(max):1.3V @ 1A;输出电压(可调):-;静态电流(Iq):-;输出类型:固定;输出电压(固定):1.2V;; Name: 1.2V; Symbol: LD1117AG-1.2V; Device: LD1117AG-1.2V; LCSC Part Name: LD1117AG-1.2V; Supplier Part: C474400; Manufacturer Part: 1.2V; Supplier Footprint: SOT-223; JLCPCB Part Class: 扩展库; Datasheet: https://atta.szlcsc.com/upload/public/pdf/source/20191223/C474400_9AE606E850347ECEADA860D4C51D5FA4.pdf; Supplier: LCSC; Convert to PCB: yes
U12 = EPCS64SI16N: Add into BOM: yes; Name: EPCS64SI16N; Symbol: EPCS64SI16N; Device: EPCS64SI16N; LCSC Part Name: EPCS64SI16N; Supplier Part: C3040245; Manufacturer Part: EPCS64SI16N; Supplier Footprint: SOIC-16-7.50mm 宽; JLCPCB Part Class: 扩展库; Datasheet: https://atta.szlcsc.comnull; Supplier: LCSC; Convert to PCB: yes
USB1 = 5286050A01: Add into BOM: yes; Name: 5286050A01; Symbol: 5286050A01; Device: 5286050A01; LCSC Part Name: 5286050A01; Supplier Part: C9900021530; Manufacturer Part: 5286050A01; Supplier Footprint: MINI-USB_5P_A; JLCPCB Part Class: 扩展库; Datasheet: https://atta.szlcsc.comnull; Supplier: LCSC; Convert to PCB: yes
X1 = 25MHz-OSC-SMD_4P-L3.2-W2.5-BL: Add into BOM: yes; Name: Oscillator50MHz, TXC  7C-50.000MBA-T; Symbol: 25MHZ-OSC-SMD_4P-L3.2-W2.5-BL; Device: 25MHz-OSC-SMD_4P-L3.2-W2.5-BL; LCSC Part Name: 25MHz-OSC-SMD_4P-L3.2-W2.5-BL; Supplier Part: C9900001618; Manufacturer Part: Oscillator50MHz, TXC  7C-50.000MBA-T; Supplier Footprint: OSC-SMD_4P-L3.2-W2.5-BL; JLCPCB Part Class: 扩展库; Datasheet: https://atta.szlcsc.comnull; Supplier: LCSC; Convert to PCB: yes